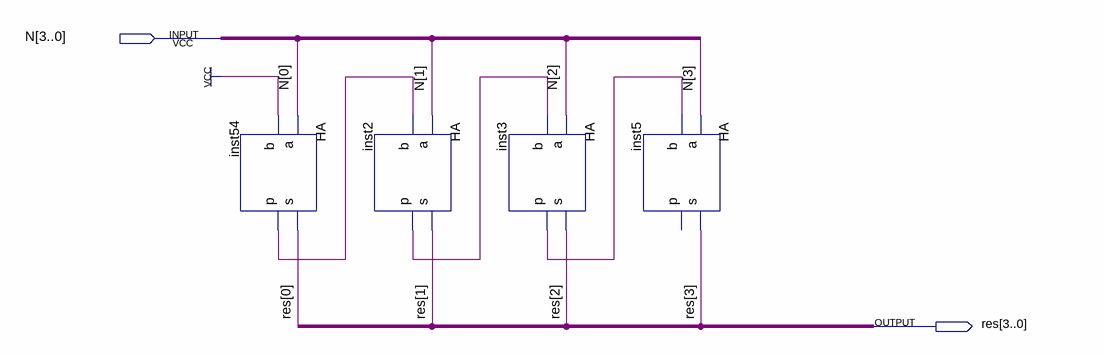
[diagram p0: schematic sheet]
// Quartus schematic add_bit.bdf as structural Verilog: 4 symbols, 2 pins
module add_bit (
  input  [3:0] N,
  output [3:0] res
);

  wire inst2_p, inst3_p, inst54_p;

  HA inst54 (.a(N[0]), .b(1'b1), .s(res[0]), .p(inst54_p));
  HA inst2 (.a(N[1]), .b(inst54_p), .s(res[1]), .p(inst2_p));
  HA inst3 (.a(N[2]), .b(inst2_p), .s(res[2]), .p(inst3_p));
  HA inst5 (.a(N[3]), .b(inst3_p), .s(res[3]));  // open: p
endmodule
